# Altium project dcbuddy_v2.PrjPcb
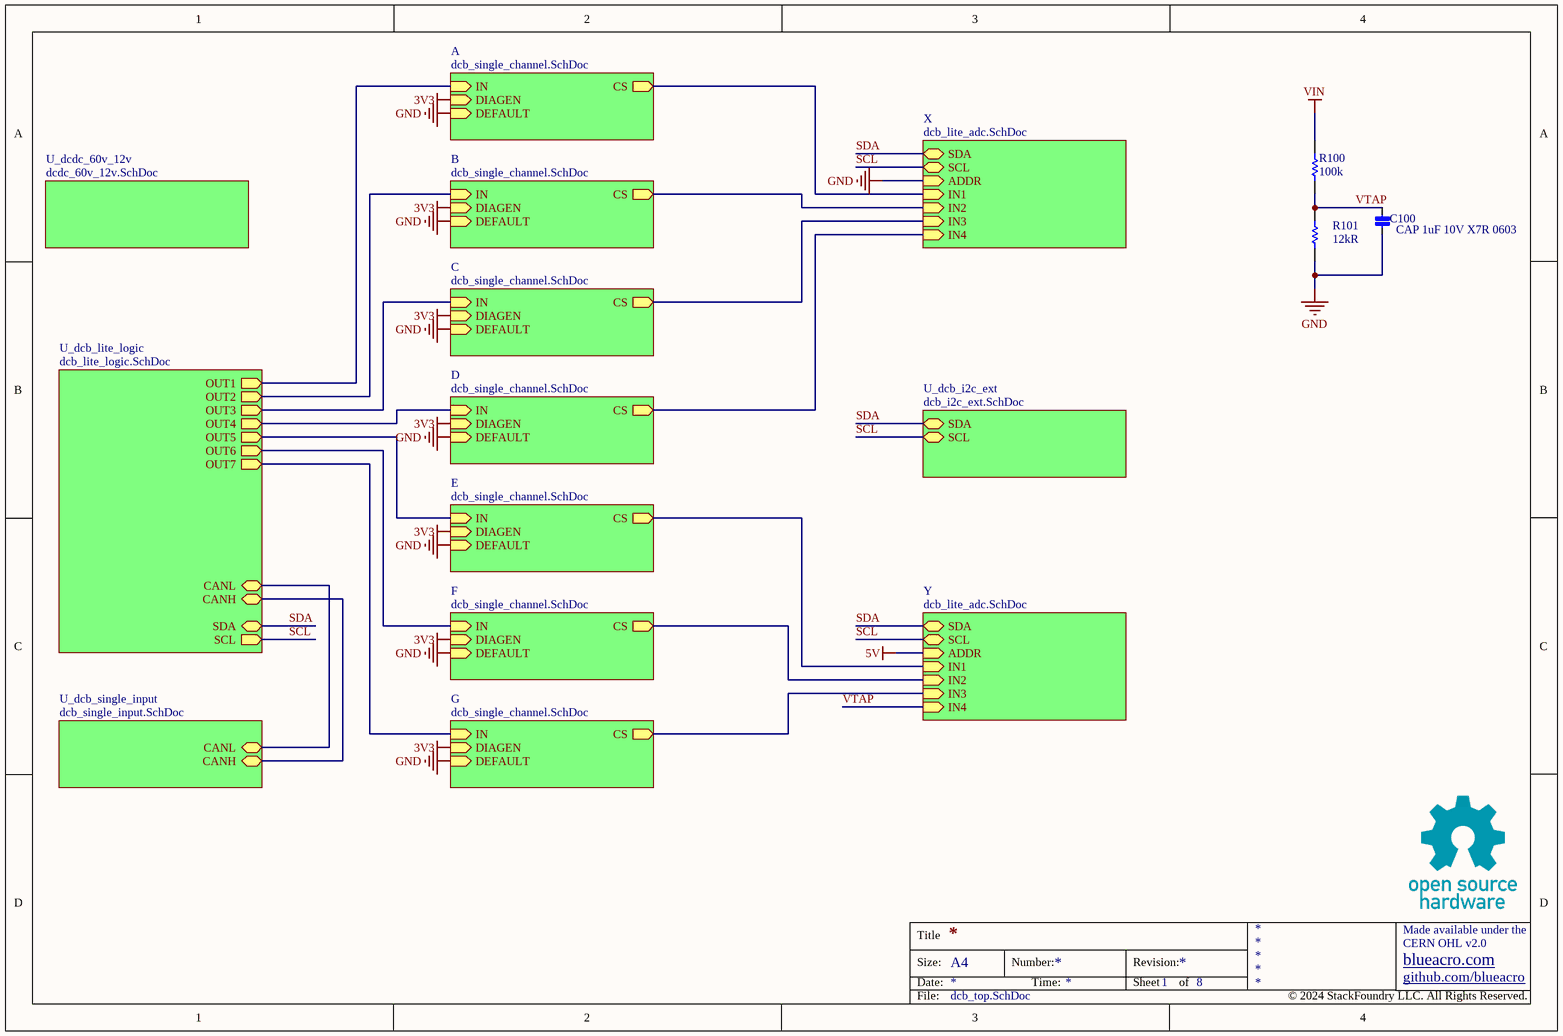
[diagram p0: dcb_top.SchDoc]
7 sheets, 161 parts. Net scope: hierarchical (ports join the sheet entries above them; power ports are global).
Board file: dcb_v2.PcbDoc
Sheets:
  dcb_top.SchDoc
    A = dcb_single_channel.SchDoc
    B = dcb_single_channel.SchDoc
    C = dcb_single_channel.SchDoc
    D = dcb_single_channel.SchDoc
    E = dcb_single_channel.SchDoc
    F = dcb_single_channel.SchDoc
    G = dcb_single_channel.SchDoc
    U_dcb_lite_logic = dcb_lite_logic.SchDoc
    X = dcb_lite_adc.SchDoc
    Y = dcb_lite_adc.SchDoc
    U_dcb_single_input = dcb_single_input.SchDoc
    U_dcdc_60v_12v = dcdc_60v_12v.SchDoc
    U_dcb_i2c_ext = dcb_i2c_ext.SchDoc

## Sheet dcb_top.SchDoc
size A4; SheetNumber: 1; SheetTotal: 8

### Parts
C100  CAP 1uF 10V X7R 0603  [FP-CL10-IPC_B]
R100  value 100k  [RESC1608-IPC-LL]  (hidden comment: 100k 0603 1%)
R101  value 12kR  [RESC1608X55X25LL10T15]  (hidden comment: 12k 0603 1%)

### Sub-sheets
A = dcb_single_channel.SchDoc: IN (in), DIAGEN (in), CS (out), DEFAULT (in)
B = dcb_single_channel.SchDoc: IN (in), DIAGEN (in), CS (out), DEFAULT (in)
C = dcb_single_channel.SchDoc: IN (in), DIAGEN (in), CS (out), DEFAULT (in)
D = dcb_single_channel.SchDoc: IN (in), DIAGEN (in), CS (out), DEFAULT (in)
E = dcb_single_channel.SchDoc: IN (in), DIAGEN (in), CS (out), DEFAULT (in)
F = dcb_single_channel.SchDoc: IN (in), DIAGEN (in), CS (out), DEFAULT (in)
G = dcb_single_channel.SchDoc: IN (in), DIAGEN (in), CS (out), DEFAULT (in)
U_dcb_i2c_ext = dcb_i2c_ext.SchDoc: SDA (bidir), SCL (bidir)
U_dcb_lite_logic = dcb_lite_logic.SchDoc: OUT1 (out), OUT2 (out), OUT3 (out), OUT4 (out), OUT5 (out), OUT6 (out), OUT7 (out), SDA (bidir), SCL (out), CANL (bidir), CANH (bidir)
U_dcb_single_input = dcb_single_input.SchDoc: CANH (bidir), CANL (bidir)
U_dcdc_60v_12v = dcdc_60v_12v.SchDoc: no entries
X = dcb_lite_adc.SchDoc: SDA (bidir), SCL (bidir), ADDR (in), IN1 (in), IN2 (in), IN3 (in), IN4 (in)
Y = dcb_lite_adc.SchDoc: SDA (bidir), SCL (bidir), ADDR (in), IN1 (in), IN2 (in), IN3 (in), IN4 (in)

### Nets
3V3: sheet A/DIAGEN, sheet B/DIAGEN, sheet C/DIAGEN, sheet D/DIAGEN, sheet E/DIAGEN, sheet F/DIAGEN, sheet G/DIAGEN
GND: C100.2 R101.1 ; sheet A/DEFAULT, sheet B/DEFAULT, sheet C/DEFAULT, sheet D/DEFAULT, sheet E/DEFAULT, sheet F/DEFAULT, sheet G/DEFAULT, sheet X/ADDR
VIN: R100.2
CANH: sheet U_dcb_lite_logic/CANH, sheet U_dcb_single_input/CANH
CANL: sheet U_dcb_lite_logic/CANL, sheet U_dcb_single_input/CANL
SCL: sheet U_dcb_lite_logic/SCL, sheet X/SCL, sheet Y/SCL, sheet U_dcb_i2c_ext/SCL
SDA: sheet U_dcb_lite_logic/SDA, sheet X/SDA, sheet Y/SDA, sheet U_dcb_i2c_ext/SDA
VTAP: C100.1 R100.1 R101.2 ; sheet Y/IN4
NetC202_A_1: sheet A/CS, sheet X/IN1
NetC202_B_1: sheet B/CS, sheet X/IN2
NetC202_C_1: sheet C/CS, sheet X/IN3
NetC202_D_1: sheet D/CS, sheet X/IN4
NetC202_E_1: sheet E/CS, sheet Y/IN1
NetC202_F_1: sheet F/CS, sheet Y/IN2
NetC202_G_1: sheet G/CS, sheet Y/IN3
NetQ200_A_1: sheet A/IN, sheet U_dcb_lite_logic/OUT1
NetQ200_B_1: sheet B/IN, sheet U_dcb_lite_logic/OUT2
NetQ200_C_1: sheet C/IN, sheet U_dcb_lite_logic/OUT3
NetQ200_D_1: sheet D/IN, sheet U_dcb_lite_logic/OUT4
NetQ200_E_1: sheet E/IN, sheet U_dcb_lite_logic/OUT5
NetQ200_F_1: sheet F/IN, sheet U_dcb_lite_logic/OUT6
NetQ200_G_1: sheet G/IN, sheet U_dcb_lite_logic/OUT7

### Notes on the sheet
- Title
- Size:
- Date:
- A4
- Number:
- Time:
- Revision:
- Sheet
- of
- github.com/blueacro
- blueacro.com
- CERN OHL v2.0
- Made available under the
- File:
- © 2024 StackFoundry LLC. All Rights Reserved.

### Library data of the parts
C100 = CMP-001-00085-7: Cap Ceramic 1uF 10V X7R 10% SMD 0603 125C Paper T/R
R100 = CMP-009-00222-1: SMD Chip Resistor, 100 kOhm, ± 1%, 100 mW, 0603 [1608 Metric], Thick Film, General Purpose; Voltage Rating: 50V; Case Code (Metric): 1608; Height: 0.45mm; Tolerance: 1%; Width: 0.8mm; Resistance Tolerance: 1%; Case/Package: 0603; Case Code (Imperial): 0603
R101 = CMP-009-00236-1: SMD Chip Resistor, 12 kOhm, ± 1%, 100 mW, 0603 [1608 Metric], Thick Film, General Purpose; Voltage Rating: 50V; Temperature Coefficient: 100ppm/°C; Power Rating: 100mW; Number of Terminations: 2; Features: Moisture Resistant; Termination: SMD/SMT; Case Code (Imperial): 0603; Pins: 2; Case Code (Metric): 1608; Depth: 0.8mm; Reach SVHC Compliant: No; Packaging: Tape and Reel; Width: 0.8mm; Resistance Tolerance: 1%; Resistor Type: Thick Film; Min Operating Temperature: -55°C; Series: RC; RoHS Compliant: Yes; Case/Package: 0603; Length: 1.6mm; Voltage Rating (DC): 50V; Lead Free: Lead Free; Max Operating Temperature: 155°C; Max Power Dissipation: 100mW; Construction: Rectangular; Tolerance: 1%; Military Standard: Not

## Sheet dcb_single_channel.SchDoc
size A4; SheetNumber: 2; SheetTotal: 8
Used 7 times, as channels A, B, C, D, E, F, G. Parts and nets are listed once, with the designators drawn on the sheet.
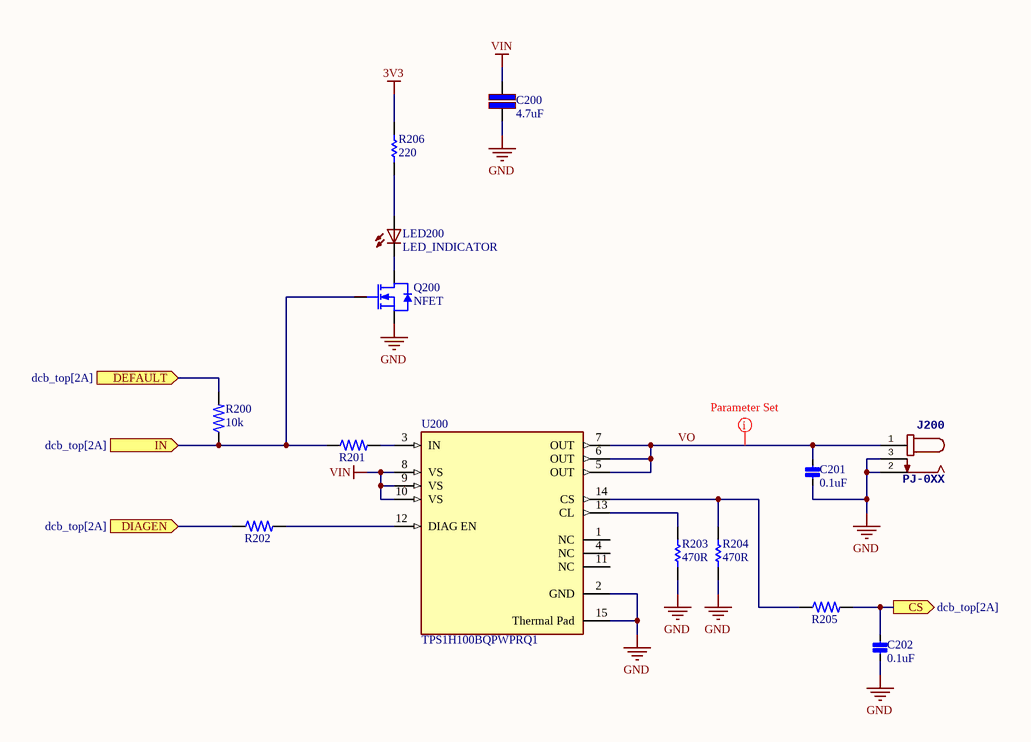
[diagram p1: dcb_single_channel.SchDoc]

### Parts
C200  value 4.7uF  [CAPC3225X20N]  (hidden comment: CAP 4.7uF 50V X7R 1210)
C201  value 0.1uF  [FP-CL10-IPC_B]  (hidden comment: CAP 0.1uF 50V X7R 0603)
C202  value 0.1uF  [FP-CL10-IPC_B]  (hidden comment: CAP 0.1uF 50V X7R 0603)
J200  PJ-0XX  [CUI-PJ-002A_V]
LED200  LED_INDICATOR  [LED5MM]
Q200  NFET  [SOT23-3]
R200  value 10k  [RESC1608-IPC-ML]  (hidden comment: 10K 0603 1%)
R201  4.7k 0603 1%  [RESC1608-IPC-ML]  (value not drawn)
R202  4.7k 0603 1%  [RESC1608-IPC-ML]  (value not drawn)
R203  value 470R  [RESC2013X60X35LL10T20]  (hidden comment: RC0805FR-07470RL)
R204  value 470R  [RESC2013X60X35LL10T20]  (hidden comment: RC0805FR-07470RL)
R205  4.7k 0603 1%  [RESC1608-IPC-ML]  (value not drawn)
R206  value 220  [RESC1608-IPC-ML]  (hidden comment: 220R 0603 5%)
U200  TPS1H100BQPWPRQ1  [FP-PWP0014C-IPC_C]

### Ports
CS (out, see dcb_top[2A]), DEFAULT (in, see dcb_top[2A]), DIAGEN (in, see dcb_top[2A]), IN (in, see dcb_top[2A])

### Nets
3V3: R206.2
GND: C200.1 C201.2 C202.2 J200.2 J200.3 Q200.2(S) R203.1 R204.1 U200.2(GND) U200.15(Thermal_Pad)
VIN: C200.2 U200.8(VS) U200.9(VS) U200.10(VS)
CS: C202.1 R205.2 ; port CS
DEFAULT: R200.2 ; port DEFAULT
DIAGEN: R202.1 ; port DIAGEN
IN: Q200.1(G) R200.1 R201.1 ; port IN
VO: C201.1 J200.1 U200.5(OUT) U200.6(OUT) U200.7(OUT)
NetLED200_A: LED200.A R206.1
NetLED200_C: LED200.C Q200.3(D)
NetR201_2: R201.2 U200.3(IN)
NetR202_2: R202.2 U200.12(DIAG_EN)
NetR203_2: R203.2 U200.13(CL)
NetR204_2: R204.2 R205.1 U200.14(CS)

Not connected (* = marked no-connect by the designer): U200 1(NC) 4(NC) 11(NC)

### Channels
A: designators end in _A; ports CS=NetC202_A_1 DEFAULT=GND DIAGEN=3V3 IN=NetQ200_A_1
B: designators end in _B; ports CS=NetC202_B_1 DEFAULT=GND DIAGEN=3V3 IN=NetQ200_B_1
C: designators end in _C; ports CS=NetC202_C_1 DEFAULT=GND DIAGEN=3V3 IN=NetQ200_C_1
D: designators end in _D; ports CS=NetC202_D_1 DEFAULT=GND DIAGEN=3V3 IN=NetQ200_D_1
E: designators end in _E; ports CS=NetC202_E_1 DEFAULT=GND DIAGEN=3V3 IN=NetQ200_E_1
F: designators end in _F; ports CS=NetC202_F_1 DEFAULT=GND DIAGEN=3V3 IN=NetQ200_F_1
G: designators end in _G; ports CS=NetC202_G_1 DEFAULT=GND DIAGEN=3V3 IN=NetQ200_G_1

### Layout directives
net class HV: VO_A

### Notes on the sheet
- Title
- Size:
- Date:
- A4
- Number:
- Time:
- Revision:
- Sheet
- of
- github.com/blueacro
- blueacro.com
- CERN OHL v2.0
- Made available under the
- File:
- © 2024 StackFoundry LLC. All Rights Reserved.

### Library data of the parts
C200 = CMP-001-00083-3: CAP CER 4.7UF 50V X7R 1210; Tolerance: 10%; Material: Ceramic; Voltage: 50V; Capacitance: 4.7uF; Width: 0.098inch; Height: 1.8mm; Depth: 2.5mm; Package Quantity: 1; Case/Package: 1210; Case Code (Imperial): 1210; Contact Plating: Tin; Thickness: 0.079inch; Radiation Hardening: No; Voltage Rating: 50V; Packaging: Tape and Reel; Lead Free: Lead Free; Dielectric: X7R; Min Operating Temperature: -55°C; Case Code (Metric): 3225; Max Operating Temperature: 125°C; Mount: Surface Mount; Length: 3.2mm
C201 C202 = CMP-001-00084-7: Cap Ceramic 0.1uF 50V X7R 20% SMD 0603 125C Paper T/R; Voltage: 50V
J200 = CMP-167-0003-2: 2.0 x 6.5 mm, 2.5 A, Horizontal, Through Hole, Dc Power Jack Connector; Design Item ID: PJ-0XX; Source: con-jack.SCHLIB
LED200 = CMP-130-0003-6: Source: led.SchLib; Design Item ID: LED_INDICATOR
Q200 = CMP-094-0000-1: Design Item ID: NFET; Source: fet.SchLib
R200 = CMP-009-00191-4: Res General Purpose Thick Film 0603 10K Ohm 1% 1/10W ±100ppm/°C Molded SMD Paper T/R
R201 R202 R205 = CMP-009-00205-1: RES SMD 4.7K OHM 1% 1/10W 0603
R203 R204 = CMP-009-00233-1: SMD Chip Resistor, 470 Ohm, ± 1%, 125 mW, 0805 [2012 Metric], Thick Film, General Purpose; Voltage Rating (AC): 150V; Temperature Coefficient: 100ppm/°C; Power Rating: 125mW; Min Operating Temperature: -55°C; Series: RC; Construction: Rectangular; Resistance Tolerance: 1%; Height: 0.5mm; Resistor Type: Thick Film; Pins: 2; Case Code (Imperial): 0805; Depth: 1.25mm; Reach SVHC Compliant: Unknown; Case Code (Metric): 2012; Tolerance: 1%; Max Operating Temperature: 155°C; Termination: SMD/SMT; Length: 2mm; Lead Pitch: 0.4mm; RoHS Compliant: Yes; Case/Package: 0805; Voltage Rating: 150V; Number of Terminations: 2; Features: Moisture Resistant; Packaging: Tape and Reel; Voltage Rating (DC): 150V; Width: 1.25mm; Lead Free: Lead Free; Package Quantity: 5000; Max Power Dissipation: 125mW
R206 = CMP-009-00183-3: YAGEO - RC0603JR-07220RL - SMD Chip Resistor, 0603 [1608 Metric], 220 ohm, RC Series, 75 V, Thick Film, 100 mW; Power Rating: 100mW; Working Voltage: 75V; Temperature Coefficient: 100ppm/°C; Voltage Rating (DC): 50V; Military Standard: Not; Resistance: 220R; Case Code (Metric): 1608; Max Operating Temperature: 155°C; Tolerance: 5%; Case/Package: 0603; REACH SVHC: No SVHC; Case Code (Imperial): 0603; Number of Terminations: 2; Termination: SMD/SMT; Min Operating Temperature: -55°C; Packaging: Tape and Reel; Resistor Type: Thick Film; Number of Pins: 2; Depth: 0.8mm; Voltage Rating: 50V; Width: 0.8mm; Lead Free: Lead Free; Length: 1.6mm
U200 = CMP-024-00009-1: Current Limit SW 1-IN 1-OUT 5V to 40V 4A Automotive 14-Pin HTSSOP EP T/R; Number of Channels: 1; Min Supply Voltage: 3.5V; Output Configuration: High Side; Interface: On/Off; Fault Protection: Over Temperature; Packaging: Cut Tape; Max Supply Voltage: 40V; Lead Free: Lead Free; Max Operating Temperature: 125°C; Number of Outputs: 1; Height: 1.2mm; Length: 5mm; Pins: 14; Thickness: 1mm; RoHS Compliant: Yes; Min Operating Temperature: -40°C; Case/Package: HTSSOP; Width: 4.4mm; Series: Automotive, AEC-Q100; Max Output current: 4A

## Sheet dcb_lite_logic.SchDoc
size A4; SheetNumber: 3; SheetTotal: 8
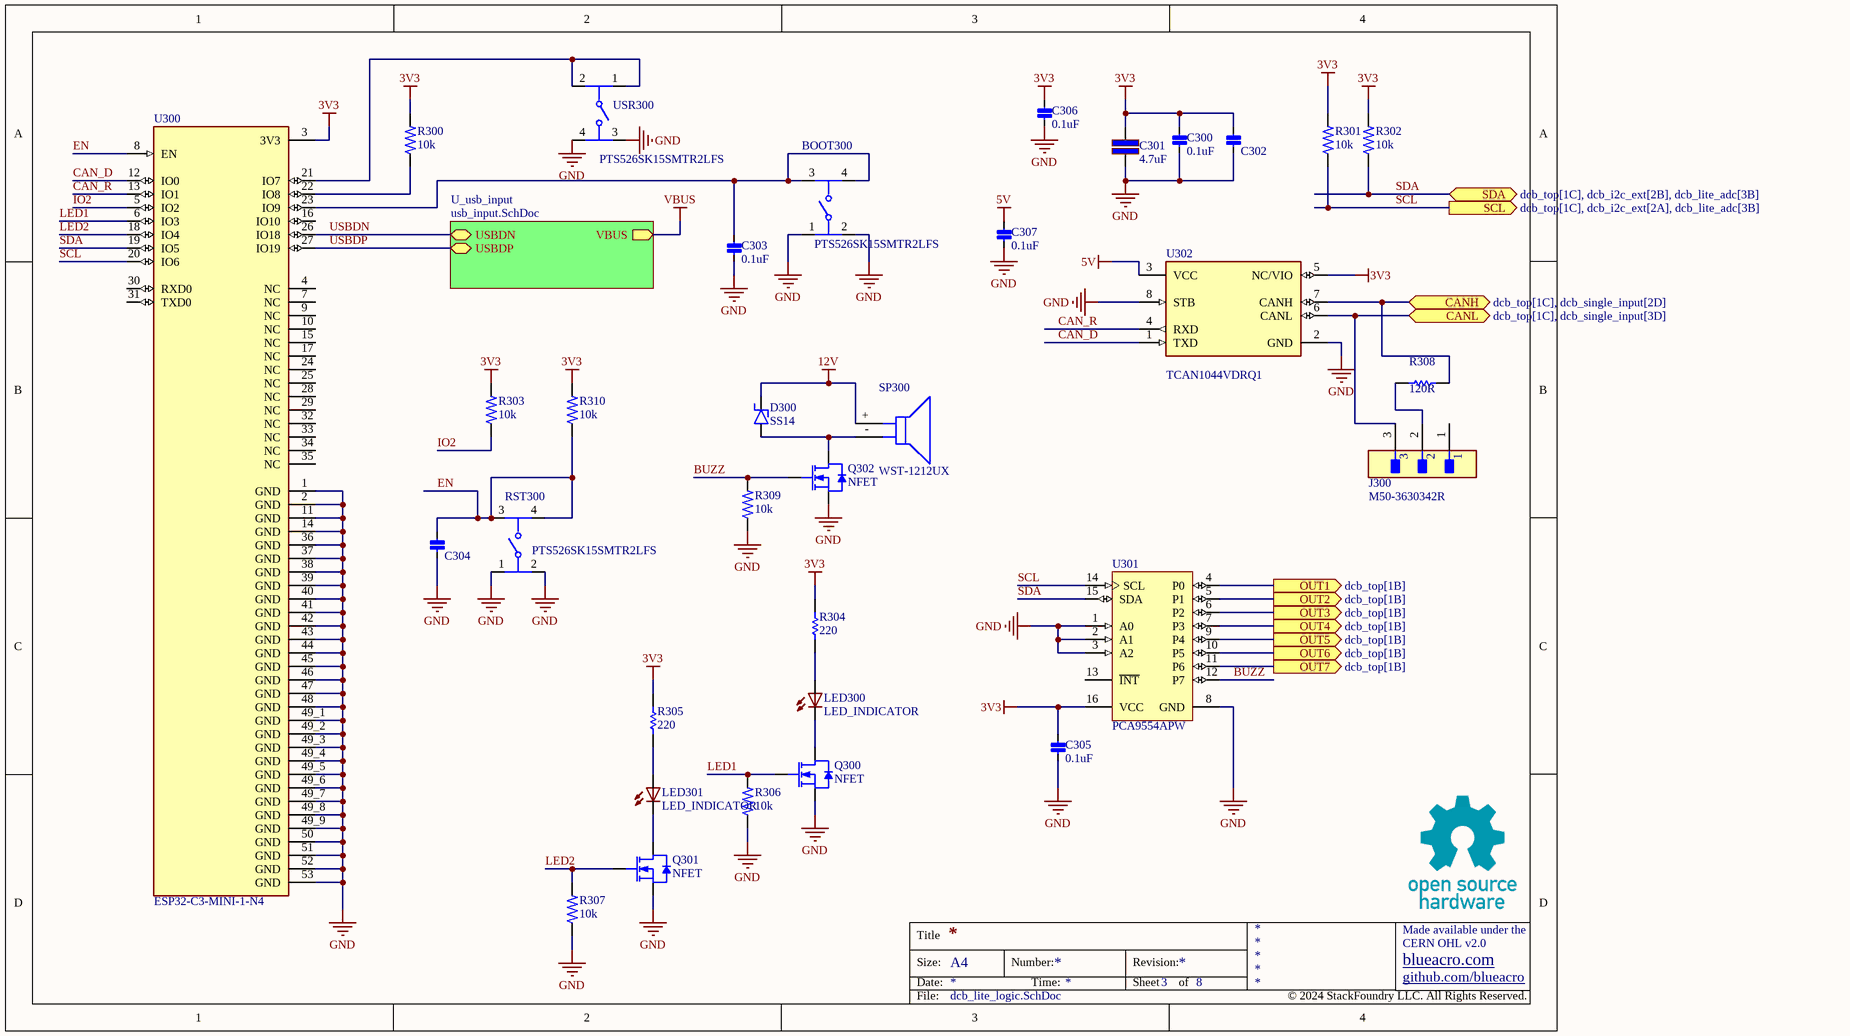
[diagram p2: dcb_lite_logic.SchDoc]

### Parts
BOOT300  PTS526SK15SMTR2LFS  [FP-PTS526SK15SMTR2LFS-MFG]
C300  value 0.1uF  [FP-CL10-IPC_B]  (hidden comment: CAP 0.1uF 50V X7R 0603)
C301  value 4.7uF  [CAPC3225X20N]  (hidden comment: CAP 4.7uF 50V X7R 1210)
C302  CAP 1uF 10V X7R 0603  [FP-CL10-IPC_B]  (value not drawn)
C303  value 0.1uF  [FP-CL10-IPC_B]  (hidden comment: CAP 0.1uF 50V X7R 0603)
C304  CAP 1uF 10V X7R 0603  [FP-CL10-IPC_B]  (value not drawn)
C305  value 0.1uF  [FP-CL10-IPC_B]  (hidden comment: CAP 0.1uF 50V X7R 0603)
C306  value 0.1uF  [FP-CL10-IPC_B]  (hidden comment: CAP 0.1uF 50V X7R 0603)
C307  value 0.1uF  [FP-CL10-IPC_B]  (hidden comment: CAP 0.1uF 50V X7R 0603)
D300  SS14  [SMA]
J300  M50-3630342R  [FP-M50-3630342R-MFG]
LED300  LED_INDICATOR  [LED5MM]
LED301  LED_INDICATOR  [LED5MM]
Q300  NFET  [SOT23-3]
Q301  NFET  [SOT23-3]
Q302  NFET  [SOT23-3]
R300  value 10k  [RESC1608-IPC-ML]  (hidden comment: 10K 0603 1%)
R301  value 10k  [RESC1608-IPC-ML]  (hidden comment: 10K 0603 1%)
R302  value 10k  [RESC1608-IPC-ML]  (hidden comment: 10K 0603 1%)
R303  value 10k  [RESC1608-IPC-ML]  (hidden comment: 10K 0603 1%)
R304  value 220  [RESC1608-IPC-ML]  (hidden comment: 220R 0603 5%)
R305  value 220  [RESC1608-IPC-ML]  (hidden comment: 220R 0603 5%)
R306  value 10k  [RESC1608-IPC-ML]  (hidden comment: 10K 0603 1%)
R307  value 10k  [RESC1608-IPC-ML]  (hidden comment: 10K 0603 1%)
R308  value 120R  [RESC3225X70X50LL20T20]  (hidden comment: 120R 1210 5%)
R309  value 10k  [RESC1608-IPC-ML]  (hidden comment: 10K 0603 1%)
R310  value 10k  [RESC1608-IPC-ML]  (hidden comment: 10K 0603 1%)
RST300  PTS526SK15SMTR2LFS  [FP-PTS526SK15SMTR2LFS-MFG]
SP300  WST-1212UX  [WST-1212UX-Footprint-1]
U300  ESP32-C3-MINI-1-N4  [XCVR_ESP32-C3-MINI-1-N4]
U301  PCA9554APW  [PW0016A_L]
U302  TCAN1044VDRQ1  [FP-D0008A-IPC_B]
USR300  PTS526SK15SMTR2LFS  [FP-PTS526SK15SMTR2LFS-MFG]

### Sub-sheets
U_usb_input = usb_input.SchDoc (file not in this document): USBDN (bidir), USBDP (bidir), VBUS (out)

### Ports
CANH (bidir, see dcb_top[1C], dcb_single_input[2D]), CANL (bidir, see dcb_top[1C], dcb_single_input[3D]), OUT1 (out, see dcb_top[1B]), OUT2 (out, see dcb_top[1B]), OUT3 (out, see dcb_top[1B]), OUT4 (out, see dcb_top[1B]), OUT5 (out, see dcb_top[1B]), OUT6 (out, see dcb_top[1B]), OUT7 (out, see dcb_top[1B]), SCL (out, see dcb_top[1C], dcb_i2c_ext[2A], dcb_lite_adc[3B]), SDA (bidir, see dcb_top[1C], dcb_i2c_ext[2B], dcb_lite_adc[3B])

### Nets
3V3: C300.1 C301.2 C302.1 C305.1 C306.1 R300.2 R301.2 R302.2 R303.2 R304.2 R305.2 R310.2 U300.3(3V3) U301.16(VCC) U302.5(NC/VIO)
5V: C307.1 U302.3(VCC)
12V: D300.K SP300.+
GND: BOOT300.1 BOOT300.2 C300.2 C301.1 C302.2 C303.2 C304.2 C305.2 C306.2 C307.2 Q300.2(S) Q301.2(S) Q302.2(S) R306.1 R307.1 R309.1 RST300.1 RST300.2 U300.1(GND) U300.2(GND) U300.11(GND) U300.14(GND) U300.36(GND) U300.37(GND) U300.38(GND) U300.39(GND) U300.40(GND) U300.41(GND) U300.42(GND) U300.43(GND) U300.44(GND) U300.45(GND) U300.46(GND) U300.47(GND) U300.48(GND) U300.49_1(GND) U300.49_2(GND) U300.49_3(GND) U300.49_4(GND) U300.49_5(GND) U300.49_6(GND) U300.49_7(GND) U300.49_8(GND) U300.49_9(GND) U300.50(GND) U300.51(GND) U300.52(GND) U300.53(GND) U301.1(A0) U301.2(A1) U301.3(A2) U301.8(GND) U302.2(GND) U302.8(STB) USR300.3 USR300.4
BUZZ: Q302.1(G) R309.2 U301.12(P7)
CAN_D: U300.12(IO0) U302.1(TXD)
CAN_R: U300.13(IO1) U302.4(RXD)
CANH: R308.2 U302.7(CANH) ; port CANH
CANL: J300.3 U302.6(CANL) ; port CANL
EN: C304.1 R310.1 RST300.3 RST300.4 U300.8(EN)
IO2: R303.1 U300.5(IO2)
LED1: Q300.1(G) R306.2 U300.6(IO3)
LED2: Q301.1(G) R307.2 U300.18(IO4)
SCL: R301.1 U300.20(IO6) U301.14(SCL) ; port SCL
SDA: R302.1 U300.19(IO5) U301.15(SDA) ; port SDA
USBDN: U300.26(IO18) ; sheet U_usb_input/USBDN
USBDP: U300.27(IO19) ; sheet U_usb_input/USBDP
NetBOOT300_3: BOOT300.3 BOOT300.4 C303.1 U300.23(IO9)
NetD300_A: D300.A Q302.3(D) SP300.-
NetJ300_2: J300.2 R308.1
NetLED300_A: LED300.A R304.1
NetLED300_C: LED300.C Q300.3(D)
NetLED301_A: LED301.A R305.1
NetLED301_C: LED301.C Q301.3(D)
NetQ200_A_1: U301.4(P0) ; port OUT1
NetQ200_B_1: U301.5(P1) ; port OUT2
NetQ200_C_1: U301.6(P2) ; port OUT3
NetQ200_D_1: U301.7(P3) ; port OUT4
NetQ200_E_1: U301.9(P4) ; port OUT5
NetQ200_F_1: U301.10(P5) ; port OUT6
NetQ200_G_1: U301.11(P6) ; port OUT7
NetR300_1: R300.1 U300.22(IO8)
NetU300_21: U300.21(IO7) USR300.1 USR300.2

Not connected (* = marked no-connect by the designer): J300 1; U300 4(NC) 7(NC) 9(NC) 10(NC) 15(NC) 16(IO10) 17(NC) 24(NC) 25(NC) 28(NC) 29(NC) 30(RXD0) 31(TXD0) 32(NC) 33(NC) 34(NC) 35(NC); U301 13(~{INT})

### Notes on the sheet
- Title
- Size:
- Date:
- A4
- Number:
- Time:
- Revision:
- Sheet
- of
- github.com/blueacro
- blueacro.com
- CERN OHL v2.0
- Made available under the
- File:
- © 2024 StackFoundry LLC. All Rights Reserved.

### Library data of the parts
BOOT300 RST300 USR300 = CMP-011-00015-1: Switch Tactile N.O. SPST Round Button Gull Wing 0.05A 12VDC 200000Cycles 2.45N SMD T/R; Contact Current Rating: 50mA; Illumination Type: Non-Illuminated; Contact Resistance: 100mR; Number of Positions: 2; Switch Function: Off-Mom; Actuator Type: Standard; Operating Force: 260gf; Voltage Rating (DC): 12V; Ratings: IP40; Switch Travel: 0.25mm; Max Operating Temperature: 70°C; Mechanical Life: 200000Cycles; Termination: Gull Wing; Throw Configuration: SPST; Series: PTS526; Height: 1.65mm; Mounting Technology: Surface Mount; Min Operating Temperature: -20°C
C300 C303 C305-C307 = CMP-001-00084-7: as C201 on sheet dcb_single_channel; Voltage: 50V
C301 = CMP-001-00083-3: as C200 on sheet dcb_single_channel; Voltage: 50V; Capacitance: 4.7uF; Width: 0.098inch; Height: 1.8mm; Depth: 2.5mm; Package Quantity: 1; Case/Package: 1210; Case Code (Imperial): 1210; Contact Plating: Tin; Thickness: 0.079inch; Radiation Hardening: No; Voltage Rating: 50V; Packaging: Tape and Reel; Lead Free: Lead Free; Dielectric: X7R; Min Operating Temperature: -55°C; Case Code (Metric): 3225; Max Operating Temperature: 125°C; Mount: Surface Mount; Length: 3.2mm
C302 C304 = CMP-001-00085-7: as C100 on sheet dcb_top
D300 = CMP-080-0002-2: Source: diode.SCHLIB; Design Item ID: DIODE_SCHOTTKY
J300 = CMP-002-00105-2: 3 Pos. Male SIL Vertical SMT Conn. RoHS Compliant: Yes; Current Rating: 1A; Number of Positions: 3; Connector Type: Header; RoHS Compliant: Yes; Series: Archer M50; Fastening Type: Pull; Min Operating Temperature: -40°C; Termination: Solder; Contact Material: Brass; Mounting Technology: Surface Mount; Packaging: Cut Tape; Contact Finish - Mating: GOLD; Contact Shape: Square; Insulation Color: Black; Contact Type: Male Pin; Max Operating Temperature: 105°C; Flammability Rating: UL94 V-0; Insulation Material: Nylon; Number of Rows: 1
LED300 LED301 = CMP-130-0003-6: Source: led.SchLib; Design Item ID: LED_INDICATOR
Q300-Q302 = CMP-094-0000-1: Design Item ID: NFET; Source: fet.SchLib
R300-R303 R306 R307 R309 R310 = CMP-009-00191-4: as R200 on sheet dcb_single_channel
R304 R305 = CMP-009-00183-3: as R206 on sheet dcb_single_channel; Military Standard: Not; Resistance: 220R; Case Code (Metric): 1608; Max Operating Temperature: 155°C; Tolerance: 5%; Case/Package: 0603; REACH SVHC: No SVHC; Case Code (Imperial): 0603; Number of Terminations: 2; Termination: SMD/SMT; Min Operating Temperature: -55°C; Packaging: Tape and Reel; Resistor Type: Thick Film; Number of Pins: 2; Depth: 0.8mm; Voltage Rating: 50V; Width: 0.8mm; Lead Free: Lead Free; Length: 1.6mm
R308 = CMP-009-00240-1: SMD Chip Resistor, 120 Ohm, ± 5%, 500 mW, 1210 [3225 Metric], Thick Film, General Purpose; Voltage Rating: 200V; Power Rating: 500mW; Temperature Coefficient: 200ppm/°C; Tolerance: 5%; Case/Package: 1210; Mounting Technology: Surface Mount; Radiation Hardening: No; Reach SVHC Compliant: No; Military Standard: Not; Length: 3.2mm; Max Power Dissipation: 500mW; Max Operating Temperature: 155°C; RoHS Compliant: Yes; Series: ERJ; Height: 0.6mm; Construction: Rectangular; Termination: SMD/SMT; Case Code (Metric): 3225; Width: 2.5mm; Package Quantity: 1; Packaging: Tape and Reel; Technology: THICK FILM; Number of Terminations: 2; Case Code (Imperial): 1210; Depth: 2.5mm; Features: Automotive AEC-Q200; Contact Plating: Tin; Resistance Tolerance: 5%; Voltage Rating (DC): 200V; Min Operating Temperature: -55°C; Resistor Type: Thick Film
SP300 = CMP-00027-00003-3: Audio Magnetic Xdcr 9-15V Th; Frequency: 2.3kHz; Mounting Technology: Through Hole; Min Operating Temperature: -20°C; Max Operating Temperature: 60°C
U300 = CMP-206-000000-1: Bluetooth, WiFi 802.11b/g/n, Bluetooth v5.0 Transceiver Module 2.412GHz ~ 2.484GHz PCB Trace Surface Mount; MF: Espressif Systems; Availability: In Stock; Purchase-URL: https://pricing.snapeda.com/search/part/ESP32-C3-MINI-1-N4/?ref=eda; MP: ESP32-C3-MINI-1-N4; Source: ESP32-C3-MINI-1-N4.SchLib; Check_prices: https://www.snapeda.com/parts/ESP32-C3-MINI-1-N4/Espressif+Systems/view-part/?ref=eda; Pin Count: 61; Design Item ID: ESP32-C3-MINI-1-N4; Price: None; Component Type: Standard; Package: SMD-53 Espressif Systems; SnapEDA_Link: https://www.snapeda.com/parts/ESP32-C3-MINI-1-N4/Espressif+Systems/view-part/?ref=snap; Value: *
U301 = CMP-015-00016-1: I2C/SMBus Interface 100kHz/400kHz 5.5V 16-Pin TSSOP Tube / IC I/O EXPANDER I2C 8B 16TSSOP; Number of Outputs: 8; Output Type: PUSH-PULL; Clock Frequency: 400kHz; Operating Supply Current: 104uA; Pins: 16; Operating Supply Voltage: 5.5V; Case/Package: TSSOP; Packaging: Rail/Tube; Weight: 0.002183oz; Lead Free: Lead Free; Radiation Hardening: No; Thickness: 1mm; Number of I/Os: 8; Length: 5mm; Max Operating Temperature: 85°C; Width: 4.4mm; RoHS Compliant: Yes; Height: 1.2mm; Series: -; Frequency: 400kHz; Min Operating Temperature: -40°C
U302 = CMP-015-00017-1: R-PDSO-G8 TCAN1044 Tape & Reel (TR) CAN interface transceiver 100mV 4.905mm 5Mbps -40C~125C TA; Min Supply Voltage: 4.5V; Max Supply Voltage: 5.5V; Min Operating Temperature: -40°C; Data Rate: 5Mbps; Series: Automotive, AEC-Q100; RoHS Compliant: Yes; Max Operating Temperature: 125°C; Length: 4.9mm; Pins: 8; Thickness: 1.58mm; Height: 1.75mm; Width: 3.91mm; Case/Package: SOIC; Mounting Technology: Surface Mount; Interface: CAN; Receiver Hysteresis: 100mV

## Sheet dcb_lite_adc.SchDoc
size A4; SheetNumber: 5; SheetTotal: 8
Used 2 times, as channels X, Y. Parts and nets are listed once, with the designators drawn on the sheet.
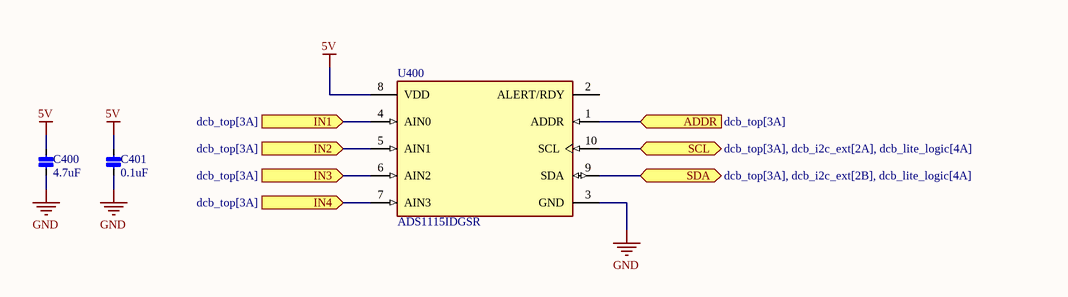
[diagram p3: dcb_lite_adc.SchDoc]

### Parts
C400  value 4.7uF  [FP-CL10-IPC_C]  (hidden comment: CAP 4.7uF 0603 6.3V X7R)
C401  value 0.1uF  [FP-CL10-IPC_B]  (hidden comment: CAP 0.1uF 50V X7R 0603)
U400  ADS1115IDGSR  [FP-DGS0010A-MFG]

### Ports
ADDR (in, see dcb_top[3A]), IN1 (in, see dcb_top[3A]), IN2 (in, see dcb_top[3A]), IN3 (in, see dcb_top[3A]), IN4 (in, see dcb_top[3A]), SCL (bidir, see dcb_top[3A], dcb_i2c_ext[2A], dcb_lite_logic[4A]), SDA (bidir, see dcb_top[3A], dcb_i2c_ext[2B], dcb_lite_logic[4A])

### Nets
5V: C400.1 C401.1 U400.8(VDD)
GND: C400.2 C401.2 U400.3(GND)
ADDR: U400.1(ADDR) ; port ADDR
IN1: U400.4(AIN0) ; port IN1
IN2: U400.5(AIN1) ; port IN2
IN3: U400.6(AIN2) ; port IN3
IN4: U400.7(AIN3) ; port IN4
SCL: U400.10(SCL) ; port SCL
SDA: U400.9(SDA) ; port SDA

Not connected (* = marked no-connect by the designer): U400 2(ALERT/RDY)

### Channels
X: designators end in _X; ports ADDR=GND IN1=NetC202_A_1 IN2=NetC202_B_1 IN3=NetC202_C_1 IN4=NetC202_D_1 SCL=SCL SDA=SDA
Y: designators end in _Y; ports ADDR=5V IN1=NetC202_E_1 IN2=NetC202_F_1 IN3=NetC202_G_1 IN4=VTAP SCL=SCL SDA=SDA

### Notes on the sheet
- Title
- Size:
- Date:
- A4
- Number:
- Time:
- Revision:
- Sheet
- of
- github.com/blueacro
- blueacro.com
- CERN OHL v2.0
- Made available under the
- File:
- © 2024 StackFoundry LLC. All Rights Reserved.

### Library data of the parts
C400 = CMP-001-00101-4: Cap Ceramic 4.7uF 6.3V X7R 10% SMD 0603 125°C Paper T/R
C401 = CMP-001-00084-7: as C201 on sheet dcb_single_channel; Voltage: 50V
U400 = CMP-015-00014-1: 4-Channel Single ADC Delta-Sigma 860sps 16-bit Serial 10-Pin VSSOP T/R; Sampling Rate: 860S/s; Min Supply Voltage: 2V; Number of Inputs: 4; Number of Channels: 2; Power Dissipation: 900uW; Number of Bits: 16; Max Supply Voltage: 5.5V; Number of Converters: 1; Conversion Rate: 0.86KS/s; Integral Nonlinearity (INL): 1LSB; Polarity: Bipolar; Nominal Supply Current: 150uA; Resolution: 16b; Interface: I2C; Max Operating Temperature: 125°C; Thickness: 1.02mm; Supply Type: Single; RoHS Compliant: Yes; Length: 3mm; Min Operating Temperature: -40°C; Package Quantity: 2500; Series: -; Lead Free: Lead Free; Contact Plating: Gold; Min Supply Voltage (DC): 2V; Height: 1.07mm; Case/Package: VSSOP; Width: 3mm; Packaging: Tape and Reel; Number of A/D Converters: 1; Pins: 10; Max Supply Voltage (DC): 5.5V; Reach SVHC Compliant: No

## Sheet dcb_single_input.SchDoc
size A4; SheetNumber: 7; SheetTotal: 8
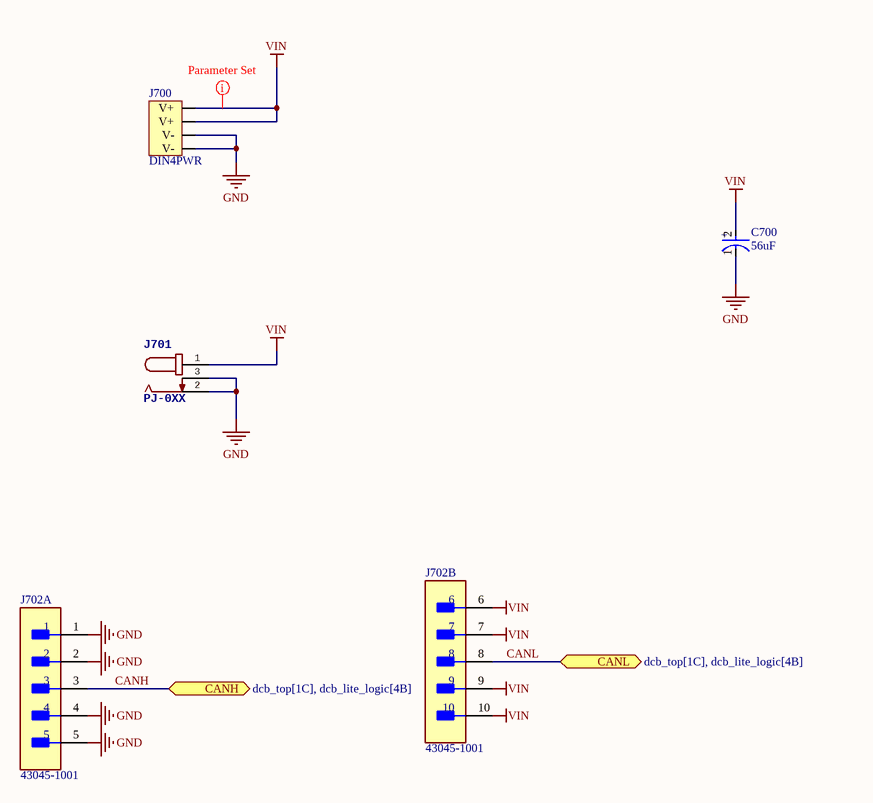
[diagram p4: dcb_single_input.SchDoc]

### Parts
C700  value 56uF  [FP-FKG-MFG]  (hidden comment: CAP 56uF 63V Poly 10mm)
J700  DIN4PWR  [PD40S]
J701  PJ-0XX  [CUI-PJ-002A_V]
J702  43045-1001  [FP-43045-1001-MFG]  (parts A,B of 2)

### Ports
CANH (bidir, see dcb_top[1C], dcb_lite_logic[4B]), CANL (bidir, see dcb_top[1C], dcb_lite_logic[4B])

### Nets
GND: C700.1(C) J700.1(V-) J700.3(V-) J701.2 J701.3 J702.1 J702.2 J702.4 J702.5
VIN: C700.2(A) J700.2(V+) J700.4(V+) J701.1 J702.6 J702.7 J702.9 J702.10
CANH: J702.3 ; port CANH
CANL: J702.8 ; port CANL

### Layout directives
net class HV: VIN

### Notes on the sheet
- Title
- Size:
- Date:
- A4
- Number:
- Time:
- Revision:
- Sheet
- of
- github.com/blueacro
- blueacro.com
- CERN OHL v2.0
- Made available under the
- File:
- © 2024 StackFoundry LLC. All Rights Reserved.
- (in symbol CMP-001-00124-1) +

### Library data of the parts
C700 = CMP-001-00124-1: Cap Aluminum 56uF 63V 20% (10 X 10.2mm) SMD 0.03 Ohm 1800mA 5000h 105 C Embossed T/R; Lead Diameter: 0.9mm; Ripple Current: 1.8A; ESR (Equivalent Series Resistance): 30mR; Material: Polymer; Leakage Current: 3uA; Life (Hours): 5000Hour; Tolerance: 20%; Diameter: 10mm; Min Operating Temperature: -55°C; Package Quantity: 500; Max Operating Temperature: 105°C; Voltage Rating (DC): 63V; Lead Pitch: 4.6mm; Ratings: AEC-Q200; Termination: SMD/SMT; Length: 10.2mm; Voltage Rating: 63V; RoHS Compliant: Yes; Ripple Current (AC): 1.8A; Series: ZA; Mounting Technology: Surface Mount,PCB; Height: 10.2mm; Radiation Hardening: No; Case/Package: Radial; Technology: HYBRID; Reach SVHC Compliant: No; Voltage: 63V; Packaging: Tape and Reel; Construction: Cylindrical; Lead Free: Lead Free
J700 = CMP-167-0005-1: Design Item ID: DIN4PWR; Source: con-jack.SCHLIB
J701 = CMP-167-0003-2: as J200 on sheet dcb_single_channel; Design Item ID: PJ-0XX; Source: con-jack.SCHLIB
J702 = CMP-002-00106-1: Connector Wire to Board Header 10 Position 3 mm Solder Right Angle Thru-Hole Micro-Fit 3.0™; Manufacturer Series: 43045; Gender: Male; DIN Conformance: No; Connector Type: Plug; Pitch: 3mm; Insulation Resistance: 1GR; Number of Contacts: 10; Glow Wire Compliant: Compliant; Voltage Rating: 600V; Voltage Rating (DC): 250V; Current Rating: 5A; Option: General Purpose; Plating: Tin; Orientation: Right Angle; Reach SVHC Compliant: No; RoHS Compliant: Yes; Flammability Rating: UL94 V-0; Contact Plating: Gold; Halogen Free: Low Halogen; Series: Micro-Fit 3.0; Packaging: Tray; Package Quantity: 1224; IEC Conformance: No; Number of Circuits: 10; MIL Conformance: No; Number of Rows: 2; Termination: Through Hole; Housing Material: Thermoplastic; Radiation Hardening: No; Row Spacing: 3mm; Contact Material: Brass; Case/Package: SMC; Number of Positions: 10; Color: Black

## Sheet dcdc_60v_12v.SchDoc
size A4; SheetNumber: 6; SheetTotal: 8; SPICEModelCacheOFSRASBJ: <root> / <DocumentId>OFSRASBJ</DocumentId> / <CacheFrame Number="0"> / <Model Name="tmk325b7226_m-pr" Kind="CKT"> / <Text>* TMK325B7226_M-PR     SPICE MODEL  ( General Type ) / *-------------------------------------------------------------------------------------------------------- / * Model Generated by TAIYO YUDEN Corporation (http://www.ty-top.com) / * Version 1.0 / * TAIYO YUDEN Control No. 170508_150330 / * Copyright(c) 2015 TAIYO YUDEN CO.,LTD. All Rights Reserved. / *-------------------------------------------------------------------------------------------------------- / * / * Products Name : Multilayer Ceramic Capacitors / * / * Characteristics : / *     Capacitance : 22 uF , Rated Voltage : 25V , TCC : X7R / *     Case Size : 3.2 x 2.5 / 0.126 x 0.098 [mm/inch] , Thickness : 2.5 / 0.098 [mm/inch] / *     (Conditions: Temperature = 25 degC , DC Bias Current/Voltage = 0A / 0V) / * / * Frequency Range : 40Hz - 3GHz / * / * External Node Assignments : / * / *  1  o---| |---o  2 / * / *-------------------------------------------------------------------------------------------------------- / .SubCkt TMK325B7226_M-PR 1 2 / **************************** / C0 1 110 20.232u / Cm 1 101 1.4192u / C1 101 102 0.46072u / Rc1 101 102 383.24 / C2 102 103 0.25707u / Rc2 102 103 27.255 / C3 103 110 0.063707u / Rc3 103 110 9.0927 / C2m 1 301 2.8514u / C21 301 302 4.5381u / Rc21 301 302 971.82 / C22 302 303 5.7922u / Rc22 302 303 294.55 / C23 303 304 5.617u / Rc23 303 304 301.8 / C24 304 305 2.3653u / Rc24 304 305 34.154 / C25 305 306 1.0031u / Rc25 305 306 28.966 / C26 306 307 0.1463u / Rc26 306 307 1.8028 / C27 307 308 0.26562u / Rc27 307 308 0.93359 / C28 308 309 0.29812u / Rc28 308 309 0.7461 / C29 309 110 3869.2p / Rc29 309 110 3.935 / Rp0 1 110 4.54545454545455Meg / L0 110 120 0.19079n / Lm 120 130 0.18902n / L1 120 121 0.21321n / RL1 121 130 0.13225 / L2 120 122 0.31017n / RL2 122 130 0.16258 / L3 120 123 1.2596n / RL3 123 130 144.01 / CR 120 124 3.8286u / LR 124 125 0.37731n / RR 125 130 10.878m / CL 130 140 3.0471p / LL 130 140 0.15642n / RL 130 140 11.971 / Rs 140 2 2.3557m / **************************** / .ends TMK325B7226_M-PR</Text> / </Model> / </CacheFrame> / </root>
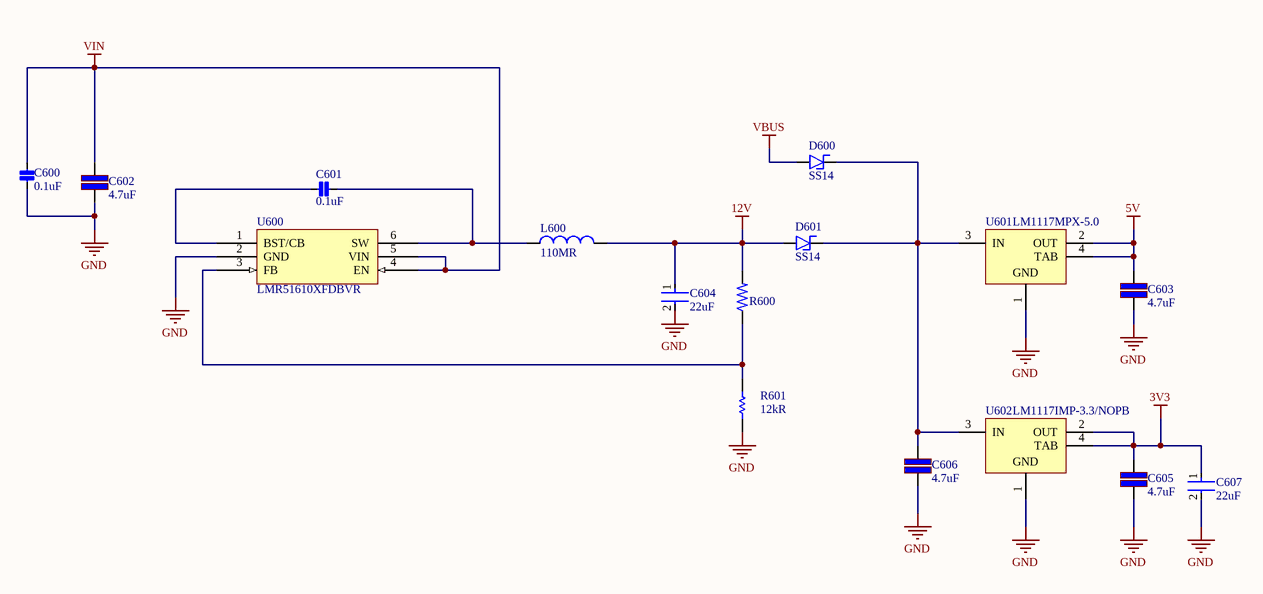
[diagram p5: dcdc_60v_12v.SchDoc]

### Parts
C600  value 0.1uF  [FP-CL10-IPC_B]  (hidden comment: CAP 0.1uF 50V X7R 0603)
C601  value 0.1uF  [FP-CL10-IPC_B]  (hidden comment: CAP 0.1uF 50V X7R 0603)
C602  value 4.7uF  [CAPC3225X20N]  (hidden comment: CAP 4.7uF 50V X7R 1210)
C603  value 4.7uF  [CAPC3225X20N]  (hidden comment: CAP 4.7uF 50V X7R 1210)
C604  value 22uF  [FP-1210-L_3_2_0_3-W_2_5_0-MFG]  (hidden comment: CAP 22uF 25V 1210 X7R)
C605  value 4.7uF  [CAPC3225X20N]  (hidden comment: CAP 4.7uF 50V X7R 1210)
C606  value 4.7uF  [CAPC3225X20N]  (hidden comment: CAP 4.7uF 50V X7R 1210)
C607  value 22uF  [FP-1210-L_3_2_0_3-W_2_5_0-MFG]  (hidden comment: CAP 22uF 25V 1210 X7R)
D600  SS14  [SMA]
D601  SS14  [SMA]
L600  value 110MR  [SRR1260-680M-Footprint-1]  (hidden comment: SRR1260-680M)
R600  100k 0603 1%  [RESC1608-IPC-LL]  (value not drawn)
R601  value 12kR  [RESC1608X55X25LL10T15]  (hidden comment: 12k 0603 1%)
U600  LMR51610XFDBVR  [SOT95P280X145-6N]
U601  LM1117MPX-5.0  [DCY0004A_M]
U602  LM1117IMP-3.3/NOPB  [DCY0004A_M]

### Nets
3V3: C605.2 C607.1 U602.2(OUT) U602.4(TAB)
5V: C603.2 U601.2(OUT) U601.4(TAB)
12V: C604.1 D601.A L600.2 R600.2
GND: C600.1 C602.1 C603.1 C604.2 C605.1 C606.1 C607.2 R601.1 U600.2(GND) U601.1(GND) U602.1(GND)
VBUS: D600.A
VIN: C600.2 C602.2 U600.4(EN) U600.5(VIN)
NetC601_1: C601.1 U600.1(BST/CB)
NetC601_2: C601.2 L600.1 U600.6(SW)
NetC606_2: C606.2 D600.K D601.K U601.3(IN) U602.3(IN)
NetR600_1: R600.1 R601.2 U600.3(FB)

### Notes on the sheet
- Title
- Size:
- Date:
- A4
- Number:
- Time:
- Revision:
- Sheet
- of
- github.com/blueacro
- blueacro.com
- CERN OHL v2.0
- Made available under the
- File:
- © 2024 StackFoundry LLC. All Rights Reserved.

### Library data of the parts
C600 C601 = CMP-001-00084-7: as C201 on sheet dcb_single_channel; Voltage: 50V
C602 C603 C605 C606 = CMP-001-00083-3: as C200 on sheet dcb_single_channel; Voltage: 50V; Capacitance: 4.7uF; Width: 0.098inch; Height: 1.8mm; Depth: 2.5mm; Package Quantity: 1; Case/Package: 1210; Case Code (Imperial): 1210; Contact Plating: Tin; Thickness: 0.079inch; Radiation Hardening: No; Voltage Rating: 50V; Packaging: Tape and Reel; Lead Free: Lead Free; Dielectric: X7R; Min Operating Temperature: -55°C; Case Code (Metric): 3225; Max Operating Temperature: 125°C; Mount: Surface Mount; Length: 3.2mm
C604 C607 = CMP-001-00125-1: 1210 22 uF 25 V ±20% Tolerance X7R Multilayer Ceramic Chip Capacitor; Tolerance: 20%; Series: M; Max Operating Temperature: 125°C; Min Operating Temperature: -55°C; Case Code (Metric): 3225; Mounting Technology: Surface Mount; Case/Package: 1210; RoHS Compliant: Yes; Voltage Rating: 25V; Packaging: Tape and Reel; Case Code (Imperial): 1210
D600 D601 = CMP-080-0002-2: Source: diode.SCHLIB; Design Item ID: DIODE_SCHOTTKY
L600 = CMP-006-00034-1: Ind Power Shielded Wirewound 68uH 20% 100KHz 22Q-Factor Ferrite 2.1A T/R; Q Factor: 22; Self Resonant Frequency: 7.43MHz; Material: Steel; Current Rating: 2.1A; Height - Seated (Max): 0.256inch; Termination: SMD/SMT; Inductance Tolerance: 20%; Package Quantity: 600; Tolerance: 20%; Max DC Current: 2.1A; Reach SVHC Compliant: No; Min Operating Temperature: -40°C; Test Frequency: 100kHz; Depth: 12.8mm; Saturation Current: 2.1A; Length: 12.5mm; Width: 12.5mm; Case/Package: 1260; RMS Current (Irms): 2.1A; Frequency: 7.43MHz; Mounting Technology: Surface Mount; Packaging: Tape and Reel; Pins: 2; DC Current: 2.1A; Shielding: Shielded; Max Operating Temperature: 125°C; Sample Rate (Hz): 100kHz; DC Resistance (DCR): 110mR; Height: 6mm; RoHS Compliant: Yes; Series: SRR1260; Military Standard: Not; Core Material: Ferrite
R600 = CMP-009-00203-1: Res Thick Film 1.6 x 0.8 mm 100K Ohm 1% 0.1W(1/10W) 100ppm/ C Molded SMD Paper T/R
R601 = CMP-009-00236-1: as R101 on sheet dcb_top; Number of Terminations: 2; Features: Moisture Resistant; Termination: SMD/SMT; Case Code (Imperial): 0603; Pins: 2; Case Code (Metric): 1608; Depth: 0.8mm; Reach SVHC Compliant: No; Packaging: Tape and Reel; Width: 0.8mm; Resistance Tolerance: 1%; Resistor Type: Thick Film; Min Operating Temperature: -55°C; Series: RC; RoHS Compliant: Yes; Case/Package: 0603; Length: 1.6mm; Voltage Rating (DC): 50V; Lead Free: Lead Free; Max Operating Temperature: 155°C; Max Power Dissipation: 100mW; Construction: Rectangular; Tolerance: 1%; Military Standard: Not
U600 = CMP-019-00077-1: SIMPLE SWITCHER® power converter with 4.5V-to-65V 1A synchronous buck and 25µA quiescent current 6-SOT-23 -40 to 150
U601 = CMP-019-00078-1: LDO Regulator Pos 5V 0.8A 4-Pin(3+Tab) SOT-223 T/R; Min Supply Voltage: 6.5V; Power Supply Rejection Ratio (PSRR): 75dB; Quiescent Current: 10mA; Dropout Voltage: 1.2V; Min Input Voltage: 2.6V; Output Current: 800mA; Number of Outputs: 1; Accuracy: 1%; Output Type: Fixed; Output Configuration: Positive; Max Supply Voltage: 15V; Current Rating: 800A; Case/Package: SOT-223; Min Operating Temperature: 0°C; Termination: SMD/SMT; Max Operating Temperature: 125°C; Reach SVHC Compliant: No; Lead Free: Contains Lead; Max Output current: 800mA; Mounting Technology: Surface Mount; Output Voltage: 5V; Packaging: Tape and Reel; Max Output Voltage: 5V; Max Supply Current: 10mA; Output Voltage Accuracy: 1%; Series: -; Pins: 4; Number of Regulators: 1; Polarity: Positive; RoHS Compliant: No
U602 = CMP-019-00080-1: LDO Regulator Pos 3.3V 0.8A 4-Pin(3+Tab) SOT-223 T/R / IC REG LDO 3.3V 0.8A SOT223; Quiescent Current: 15mA; Min Input Voltage: 2.6V; Max Output current: 800mA; Number of Channels: 1; Accuracy: 1%; Min Supply Voltage: 4.75V; Dropout Voltage: 1.2V; Polarity: Positive; Current Rating: 800A; Max Supply Voltage: 10V; Output Type: Fixed; Package Quantity: 1000; Termination: SMD/SMT; Pins: 4; Length: 6.5mm; Nominal Output Voltage: 3.3V; RoHS Compliant: Yes; Height: 1.6mm; Output Voltage Accuracy: 1%; Reach SVHC Compliant: No; Number of Outputs: 1; Lead Free: Lead Free; Min Current Limit: 800mA; Case/Package: SOT-223; Width: 3.56mm; Output Current: 800mA; Radiation Hardening: No; Thickness: 1.6mm; Packaging: Tape and Reel; Min Operating Temperature: -40°C; Number of Regulators: 1; Output Voltage: 3.3V; Max Operating Temperature: 125°C; Mounting Technology: Surface Mount

## Sheet dcb_i2c_ext.SchDoc
size A; SheetNumber: 8; SheetTotal: 8
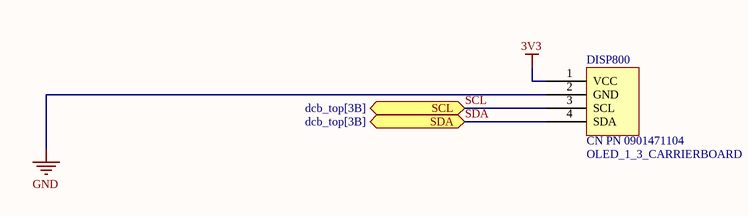
[diagram p6: dcb_i2c_ext.SchDoc]

### Parts
DISP800  OLED_1_3_CARRIERBOARD  [OLED_1_3_CARRIERBOARD-Footprint-1]

### Ports
SCL (bidir, see dcb_top[3B]), SDA (bidir, see dcb_top[3B])

### Nets
3V3: DISP800.1(VCC)
GND: DISP800.2(GND)
SCL: DISP800.3(SCL) ; port SCL
SDA: DISP800.4(SDA) ; port SDA

### Notes on the sheet
- (in symbol CMP-00028-00008-2) CN PN 0901471104

### Library data of the parts
DISP800 = CMP-00028-00008-2: Use 4 pin header 0901471104 on board

## Nets that join several sheets
3V3: A (R202_A.1 R206_A.2), B (R202_B.1 R206_B.2), C (R202_C.1 R206_C.2), D (R202_D.1 R206_D.2), E (R202_E.1 R206_E.2), F (R202_F.1 R206_F.2), G (R202_G.1 R206_G.2), dcb_lite_logic (15 pins), dcdc_60v_12v (C605.2 C607.1 U602.2 U602.4), dcb_i2c_ext (DISP800.1)
5V: dcb_lite_logic (C307.1 U302.3), X (C400_X.1 C401_X.1 U400_X.8), Y (C400_Y.1 C401_Y.1 U400_Y.1 U400_Y.8), dcdc_60v_12v (C603.2 U601.2 U601.4)
12V: dcb_lite_logic (D300.K SP300.+), dcdc_60v_12v (C604.1 D601.A L600.2 R600.2)
GND: dcb_top (C100.2 R101.1), A (11 pins), B (11 pins), C (11 pins), D (11 pins), E (11 pins), F (11 pins), G (11 pins), dcb_lite_logic (56 pins), X (C400_X.2 C401_X.2 U400_X.1 U400_X.3), Y (C400_Y.2 C401_Y.2 U400_Y.3), dcb_single_input (9 pins), dcdc_60v_12v (11 pins), dcb_i2c_ext (DISP800.2)
VIN: dcb_top (R100.2), A (C200_A.2 U200_A.8 U200_A.9 U200_A.10), B (C200_B.2 U200_B.8 U200_B.9 U200_B.10), C (C200_C.2 U200_C.8 U200_C.9 U200_C.10), D (C200_D.2 U200_D.8 U200_D.9 U200_D.10), E (C200_E.2 U200_E.8 U200_E.9 U200_E.10), F (C200_F.2 U200_F.8 U200_F.9 U200_F.10), G (C200_G.2 U200_G.8 U200_G.9 U200_G.10), dcb_single_input (8 pins), dcdc_60v_12v (C600.2 C602.2 U600.4 U600.5)
CANH: dcb_lite_logic (R308.2 U302.7), dcb_single_input (J702.3)
CANL: dcb_lite_logic (J300.3 U302.6), dcb_single_input (J702.8)
NetC202_A_1: A (C202_A.1 R205_A.2), X (U400_X.4)
NetC202_B_1: B (C202_B.1 R205_B.2), X (U400_X.5)
NetC202_C_1: C (C202_C.1 R205_C.2), X (U400_X.6)
NetC202_D_1: D (C202_D.1 R205_D.2), X (U400_X.7)
NetC202_E_1: E (C202_E.1 R205_E.2), Y (U400_Y.4)
NetC202_F_1: F (C202_F.1 R205_F.2), Y (U400_Y.5)
NetC202_G_1: G (C202_G.1 R205_G.2), Y (U400_Y.6)
NetQ200_A_1: A (Q200_A.1 R200_A.1 R201_A.1), dcb_lite_logic (U301.4)
NetQ200_B_1: B (Q200_B.1 R200_B.1 R201_B.1), dcb_lite_logic (U301.5)
NetQ200_C_1: C (Q200_C.1 R200_C.1 R201_C.1), dcb_lite_logic (U301.6)
NetQ200_D_1: D (Q200_D.1 R200_D.1 R201_D.1), dcb_lite_logic (U301.7)
NetQ200_E_1: E (Q200_E.1 R200_E.1 R201_E.1), dcb_lite_logic (U301.9)
NetQ200_F_1: F (Q200_F.1 R200_F.1 R201_F.1), dcb_lite_logic (U301.10)
NetQ200_G_1: G (Q200_G.1 R200_G.1 R201_G.1), dcb_lite_logic (U301.11)
SCL: dcb_lite_logic (R301.1 U300.20 U301.14), X (U400_X.10), Y (U400_Y.10), dcb_i2c_ext (DISP800.3)
SDA: dcb_lite_logic (R302.1 U300.19 U301.15), X (U400_X.9), Y (U400_Y.9), dcb_i2c_ext (DISP800.4)
VTAP: dcb_top (C100.1 R100.1 R101.2), Y (U400_Y.7)